# EAGLE schematic DopamineBoxSchematic (EAGLE 9.7.0)
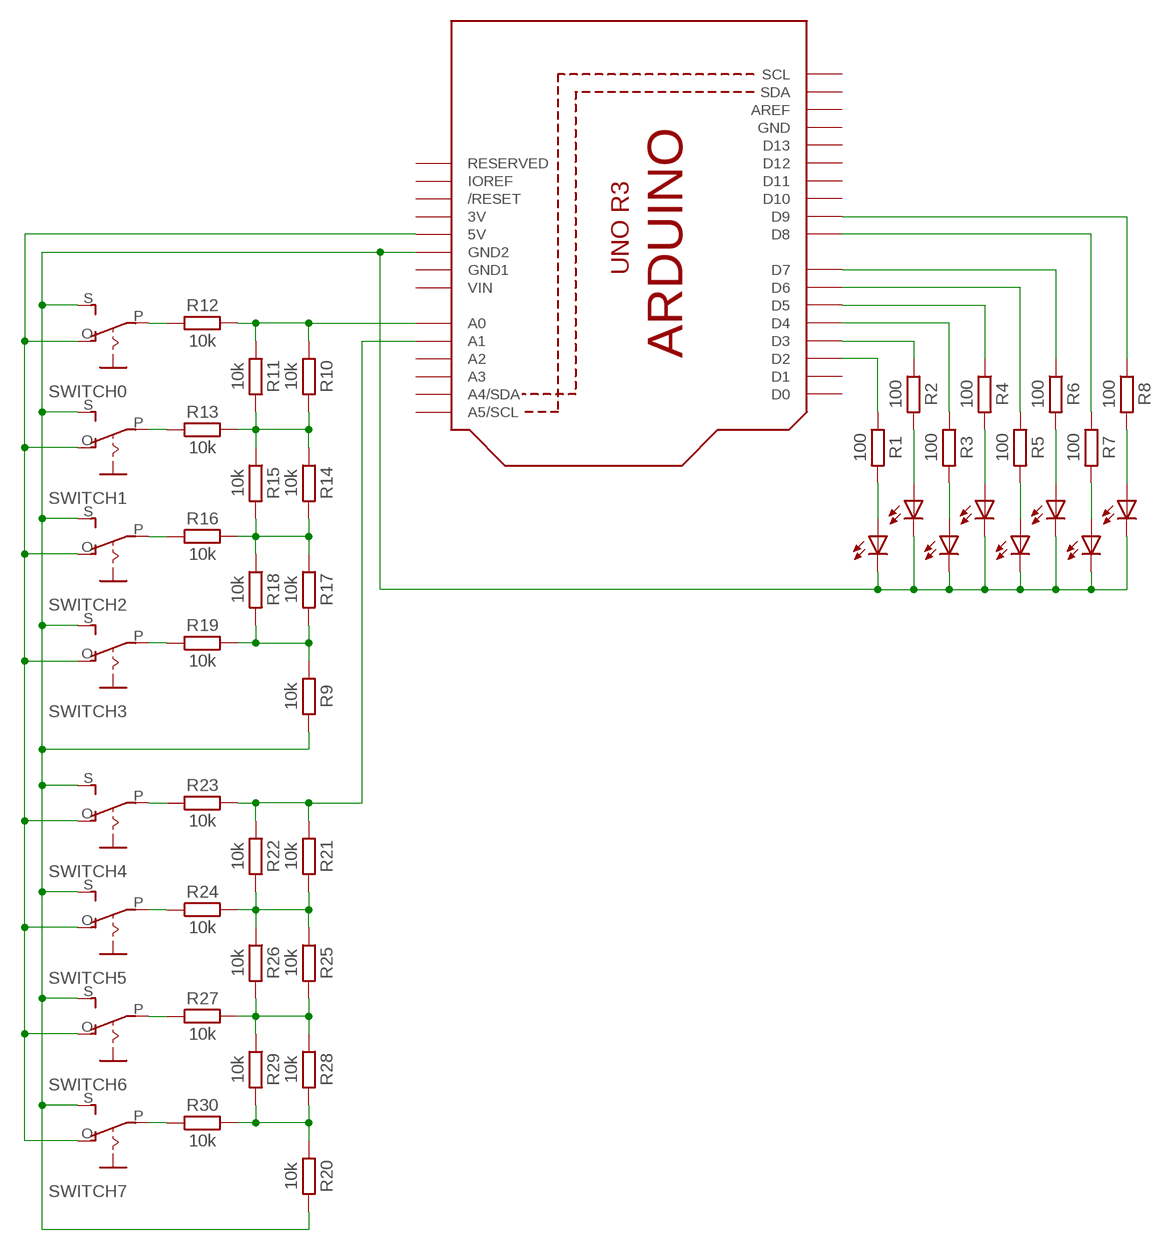
[diagram p0: schematic, sheet 1]

## Parts
LED0  LED3MM  [LED3MM]
LED2  LED3MM  [LED3MM]
LED3  LED3MM  [LED3MM]
LED4  LED3MM  [LED3MM]
LED5  LED3MM  [LED3MM]
LED6  LED3MM  [LED3MM]
LED7  LED3MM  [LED3MM]
LED8  LED3MM  [LED3MM]
R1  100  R_AXIAL-7.2MM-PITCH  [RESAD724W46L381D178B]
R2  100  R_AXIAL-7.2MM-PITCH  [RESAD724W46L381D178B]
R3  100  R_AXIAL-7.2MM-PITCH  [RESAD724W46L381D178B]
R4  100  R_AXIAL-7.2MM-PITCH  [RESAD724W46L381D178B]
R5  100  R_AXIAL-7.2MM-PITCH  [RESAD724W46L381D178B]
R6  100  R_AXIAL-7.2MM-PITCH  [RESAD724W46L381D178B]
R7  100  R_AXIAL-7.2MM-PITCH  [RESAD724W46L381D178B]
R8  100  R_AXIAL-7.2MM-PITCH  [RESAD724W46L381D178B]
R9  10k  R_AXIAL-7.2MM-PITCH  [RESAD724W46L381D178B]
R10  10k  R_AXIAL-7.2MM-PITCH  [RESAD724W46L381D178B]
R11  10k  R_AXIAL-7.2MM-PITCH  [RESAD724W46L381D178B]
R12  10k  R_AXIAL-7.2MM-PITCH  [RESAD724W46L381D178B]
R13  10k  R_AXIAL-7.2MM-PITCH  [RESAD724W46L381D178B]
R14  10k  R_AXIAL-7.2MM-PITCH  [RESAD724W46L381D178B]
R15  10k  R_AXIAL-7.2MM-PITCH  [RESAD724W46L381D178B]
R16  10k  R_AXIAL-7.2MM-PITCH  [RESAD724W46L381D178B]
R17  10k  R_AXIAL-7.2MM-PITCH  [RESAD724W46L381D178B]
R18  10k  R_AXIAL-7.2MM-PITCH  [RESAD724W46L381D178B]
R19  10k  R_AXIAL-7.2MM-PITCH  [RESAD724W46L381D178B]
R20  10k  R_AXIAL-7.2MM-PITCH  [RESAD724W46L381D178B]
R21  10k  R_AXIAL-7.2MM-PITCH  [RESAD724W46L381D178B]
R22  10k  R_AXIAL-7.2MM-PITCH  [RESAD724W46L381D178B]
R23  10k  R_AXIAL-7.2MM-PITCH  [RESAD724W46L381D178B]
R24  10k  R_AXIAL-7.2MM-PITCH  [RESAD724W46L381D178B]
R25  10k  R_AXIAL-7.2MM-PITCH  [RESAD724W46L381D178B]
R26  10k  R_AXIAL-7.2MM-PITCH  [RESAD724W46L381D178B]
R27  10k  R_AXIAL-7.2MM-PITCH  [RESAD724W46L381D178B]
R28  10k  R_AXIAL-7.2MM-PITCH  [RESAD724W46L381D178B]
R29  10k  R_AXIAL-7.2MM-PITCH  [RESAD724W46L381D178B]
R30  10k  R_AXIAL-7.2MM-PITCH  [RESAD724W46L381D178B]
SWITCH0  EG1218S  [EG1218]
SWITCH1  EG1218S  [EG1218]
SWITCH2  EG1218S  [EG1218]
SWITCH3  EG1218S  [EG1218]
SWITCH4  EG1218S  [EG1218]
SWITCH5  EG1218S  [EG1218]
SWITCH6  EG1218S  [EG1218]
SWITCH7  EG1218S  [EG1218]
U1  ARDUINOR3-BPLACE  [ARDUINOR3-BPLACE]

## Nets
N$1: LED0.A R1.2
N$2: LED2.A R2.2
N$3: LED3.A R3.2
N$4: LED4.A R4.2
N$5: LED5.A R5.2
N$6: LED6.A R6.2
N$7: LED7.A R7.2
N$8: LED8.A R8.2
N$9: R1.1 U1.D2
N$10: R2.1 U1.D3
N$11: R3.1 U1.D4
N$12: R4.1 U1.D5
N$13: R5.1 U1.D6
N$14: R6.1 U1.D7
N$15: R7.1 U1.D8
N$16: R8.1 U1.D9
N$17: R9.1 R17.2 R18.2 R19.2
N$18: R10.1 R11.1 R12.2 U1.A0
N$19: R10.2 R11.2 R13.2 R14.1 R15.1
N$20: R14.2 R15.2 R16.2 R17.1 R18.1
N$21: LED0.K(C) LED2.K(C) LED3.K(C) LED4.K(C) LED5.K(C) LED6.K(C) LED7.K(C) LED8.K(C) R9.2 R20.2 SWITCH0.S SWITCH1.S SWITCH2.S SWITCH3.S SWITCH4.S SWITCH5.S SWITCH6.S SWITCH7.S U1.GND2
N$22: R12.1 SWITCH0.P
N$23: R13.1 SWITCH1.P
N$24: R16.1 SWITCH2.P
N$25: R19.1 SWITCH3.P
N$28: R21.1 R22.1 R23.2 U1.A1
N$29: R21.2 R22.2 R24.2 R25.1 R26.1
N$30: R25.2 R26.2 R27.2 R28.1 R29.1
N$31: R20.1 R28.2 R29.2 R30.2
N$32: R23.1 SWITCH4.P
N$33: R24.1 SWITCH5.P
N$34: R27.1 SWITCH6.P
N$35: R30.1 SWITCH7.P
N$44: SWITCH0.O SWITCH1.O SWITCH2.O SWITCH3.O SWITCH4.O SWITCH5.O SWITCH6.O SWITCH7.O U1.5V
Unconnected: U1.A2 U1.A3 U1.A4(A4/SDA) U1.A5(A5/SCL) U1.AREF U1.D0 U1.D1 U1.D10 U1.D11 U1.D12 U1.D13 U1.IOREF U1.RESERVED U1.RESET(/RESET) U1.SCL U1.SDA

## Power pins joined to a net without a drawn wire
3V: U1.3V
GND: U1.GND
GND1: U1.GND1
VIN: U1.VIN

## Library data of the parts
LED0 LED2-LED8 = adafruit:LED: LED OSRAM: - CHIPLED LG R971, LG N971, LY N971, LG Q971, LY Q971, LO R971, LY R971 LH N974, LH R974 LS Q976, LO Q976, LY Q976 LO Q996 - Hyper CHIPLED LW Q18S LB Q993, LB Q99A, LB R99A - SideLED LS A670, LO A670, LY A670, LG A670, LP A670 LB A673, LV A673, LT A673, LW A673 LH A674 LY A675 LS A676, LA A676, LO A676, LY A676, LW A676 LS A679, LY A679, LG A679 - Hyper Micro SIDELED® LS Y876, LA Y876, LO Y876, LY Y876 LT Y87S - SmartLED LW L88C, LW L88S LB L89C, LB L89S, LG L890 LS L89K, LO L89K, LY L89K LS L896, LA L896, LO L896, LY L896 - TOPLED LS T670, LO T670, LY T670, LG T670, LP T670 LSG T670, LSP T670, LSY T670, LOP T670, LYG T670 LG T671, LOG T671, LSG T671 LB T673, LV T673, LT T673, LW T673 LH T674 LS T676, LA T676, LO T676, LY T676, LB T676, LH T676, LSB T676, LW T676 LB T67C, LV T67C, LT T67C, LS T67K, LO T67K, LY T67K, LW E67C LS E67B, LA E67B, LO E67B, LY E67B, LB E67C, LV E67C, LT E67C LW T67C LS T679, LY T679, LG T679 LS T770, LO T770, LY T770, LG T770, LP T770 LB T773, LV T773, LT T773, LW T773 LH T774 LS E675, LA E675, LY E675, LS T675 LS T776, LA T776, LO T776, LY T776, LB T776 LHGB T686 LT T68C, LB T68C - Hyper Mini TOPLED® LB M676 - Mini TOPLED Santana® LG M470 LS M47K, LO M47K, LY M47K Source: http://www.osram.convergy.de/
R1-R30 = Resistor:R: Resistor Fixed - Generic; CATEGORY: Resistor; SUB-CATEGORY: Fixed
SWITCH0 SWITCH1-SWITCH7 = adafruit:EG1218: SLIDING SWITCH 0.1" spacing through hole, vertical SPDT slide switch http://www.ladyada.net/library/pcb/eaglelibrary.html
U1 = adafruit:ARDUINOR3: This is a new object for the new Arduino R3 - with extra pins that you may want to use (such as IOref, and duplicated A4/A5